# Altium schematic sheet OLED.SchDoc
size A4; SheetNumber: 5; SheetTotal: 6
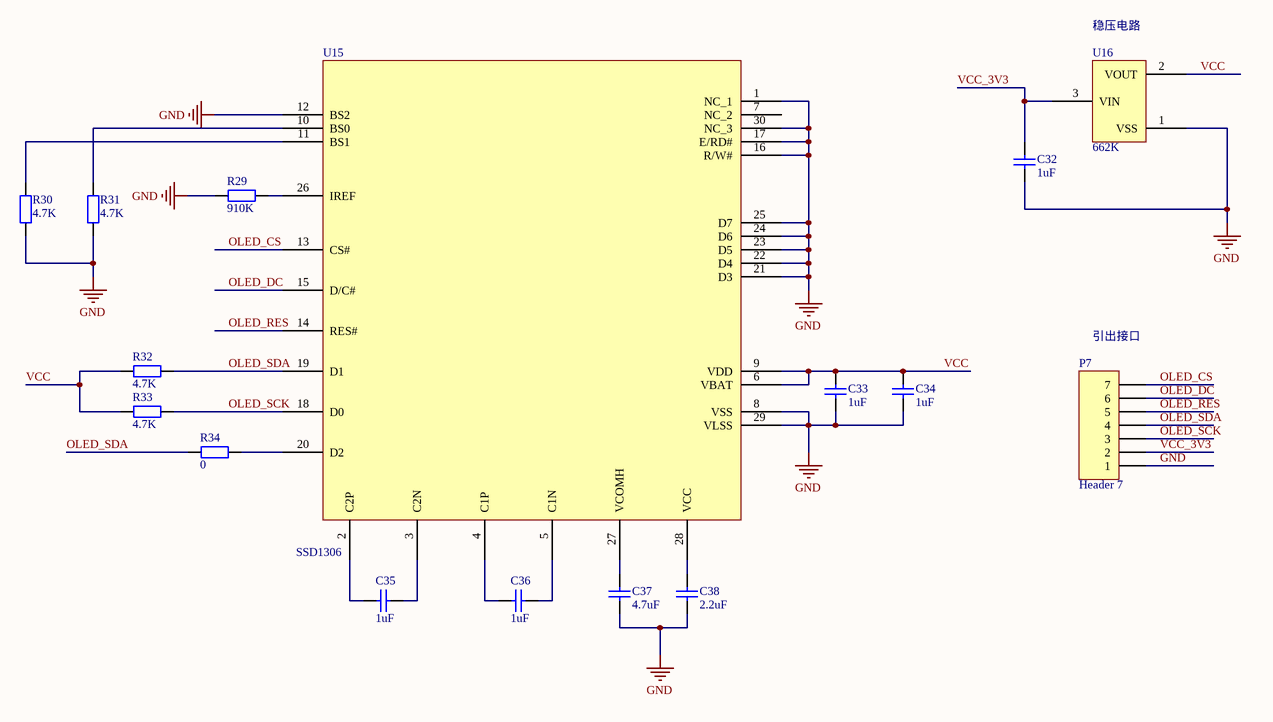
[diagram p0: OLED.SchDoc]

## Parts
C32  1uF  [C0805_L]
C33  1uF  [C0805_L]
C34  1uF  [C0805_L]
C35  1uF  [C0805_L]
C36  1uF  [C0805_L]
C37  4.7uF  [C0805_L]
C38  2.2uF  [C0805_L]
P7  Header 7  [HDR1X7]
R29  910K  [R0805_L]
R30  4.7K  [R0805_L]
R31  4.7K  [R0805_L]
R32  4.7K  [R0805_L]
R33  4.7K  [R0805_L]
R34  0  [R0805_L]
U15  SSD1306
U16  662K

## Nets
GND: C32.1 C33.2 C34.2 C37.2 C38.2 P7.1 R29.2 R30.1 R31.1 U15.1(NC_1) U15.8(VSS) U15.12(BS2) U15.16(R/W#) U15.17(E/RD#) U15.21(D3) U15.22(D4) U15.23(D5) U15.24(D6) U15.25(D7) U15.29(VLSS) U15.30(NC_3) U16.1(VSS)
OLED_CS: P7.7 U15.13(CS#)
OLED_DC: P7.6 U15.15(D/C#)
OLED_RES: P7.5 U15.14(RES#)
OLED_SCK: P7.3 R33.1 U15.18(D0)
OLED_SDA: P7.4 R32.1 R34.1 U15.19(D1)
VCC: C33.1 C34.1 R32.2 R33.2 U15.6(VBAT) U15.9(VDD) U16.2(VOUT)
VCC_3V3: C32.2 P7.2 U16.3(VIN)
NetC35_1: C35.1 U15.3(C2N)
NetC35_2: C35.2 U15.2(C2P)
NetC36_1: C36.1 U15.5(C1N)
NetC36_2: C36.2 U15.4(C1P)
NetC37_1: C37.1 U15.27(VCOMH)
NetC38_1: C38.1 U15.28(VCC)
NetR29_1: R29.1 U15.26(IREF)
NetR30_2: R30.2 U15.11(BS1)
NetR31_2: R31.2 U15.10(BS0)
NetR34_2: R34.2 U15.20(D2)

Not connected (* = marked no-connect by the designer): U15 7(NC_2)

## Notes on the sheet
- (near U16) 稳压电路
- (near P7) 引出接口

## Library data of the parts
C32-C38 = C: 贴片电容/MLCC电容; BOM名称: 无极性贴片电容; 联系下单店铺卖家 免费帮你查找封装: 联系下单店铺卖家 免费技术支持
P7 = Header 7: Header, 7-Pin; LatestRevisionDate: 17-Jul-2002; LatestRevisionNote: Re-released for DXP Platform.; Publisher: Altium Limited
R29-R34 = R: 贴片电阻; 当前库版本V2022.10.7 @黄晶宝石: 最新版本发布https://shop463601444.taobao.com; BOM名称: 贴片电阻